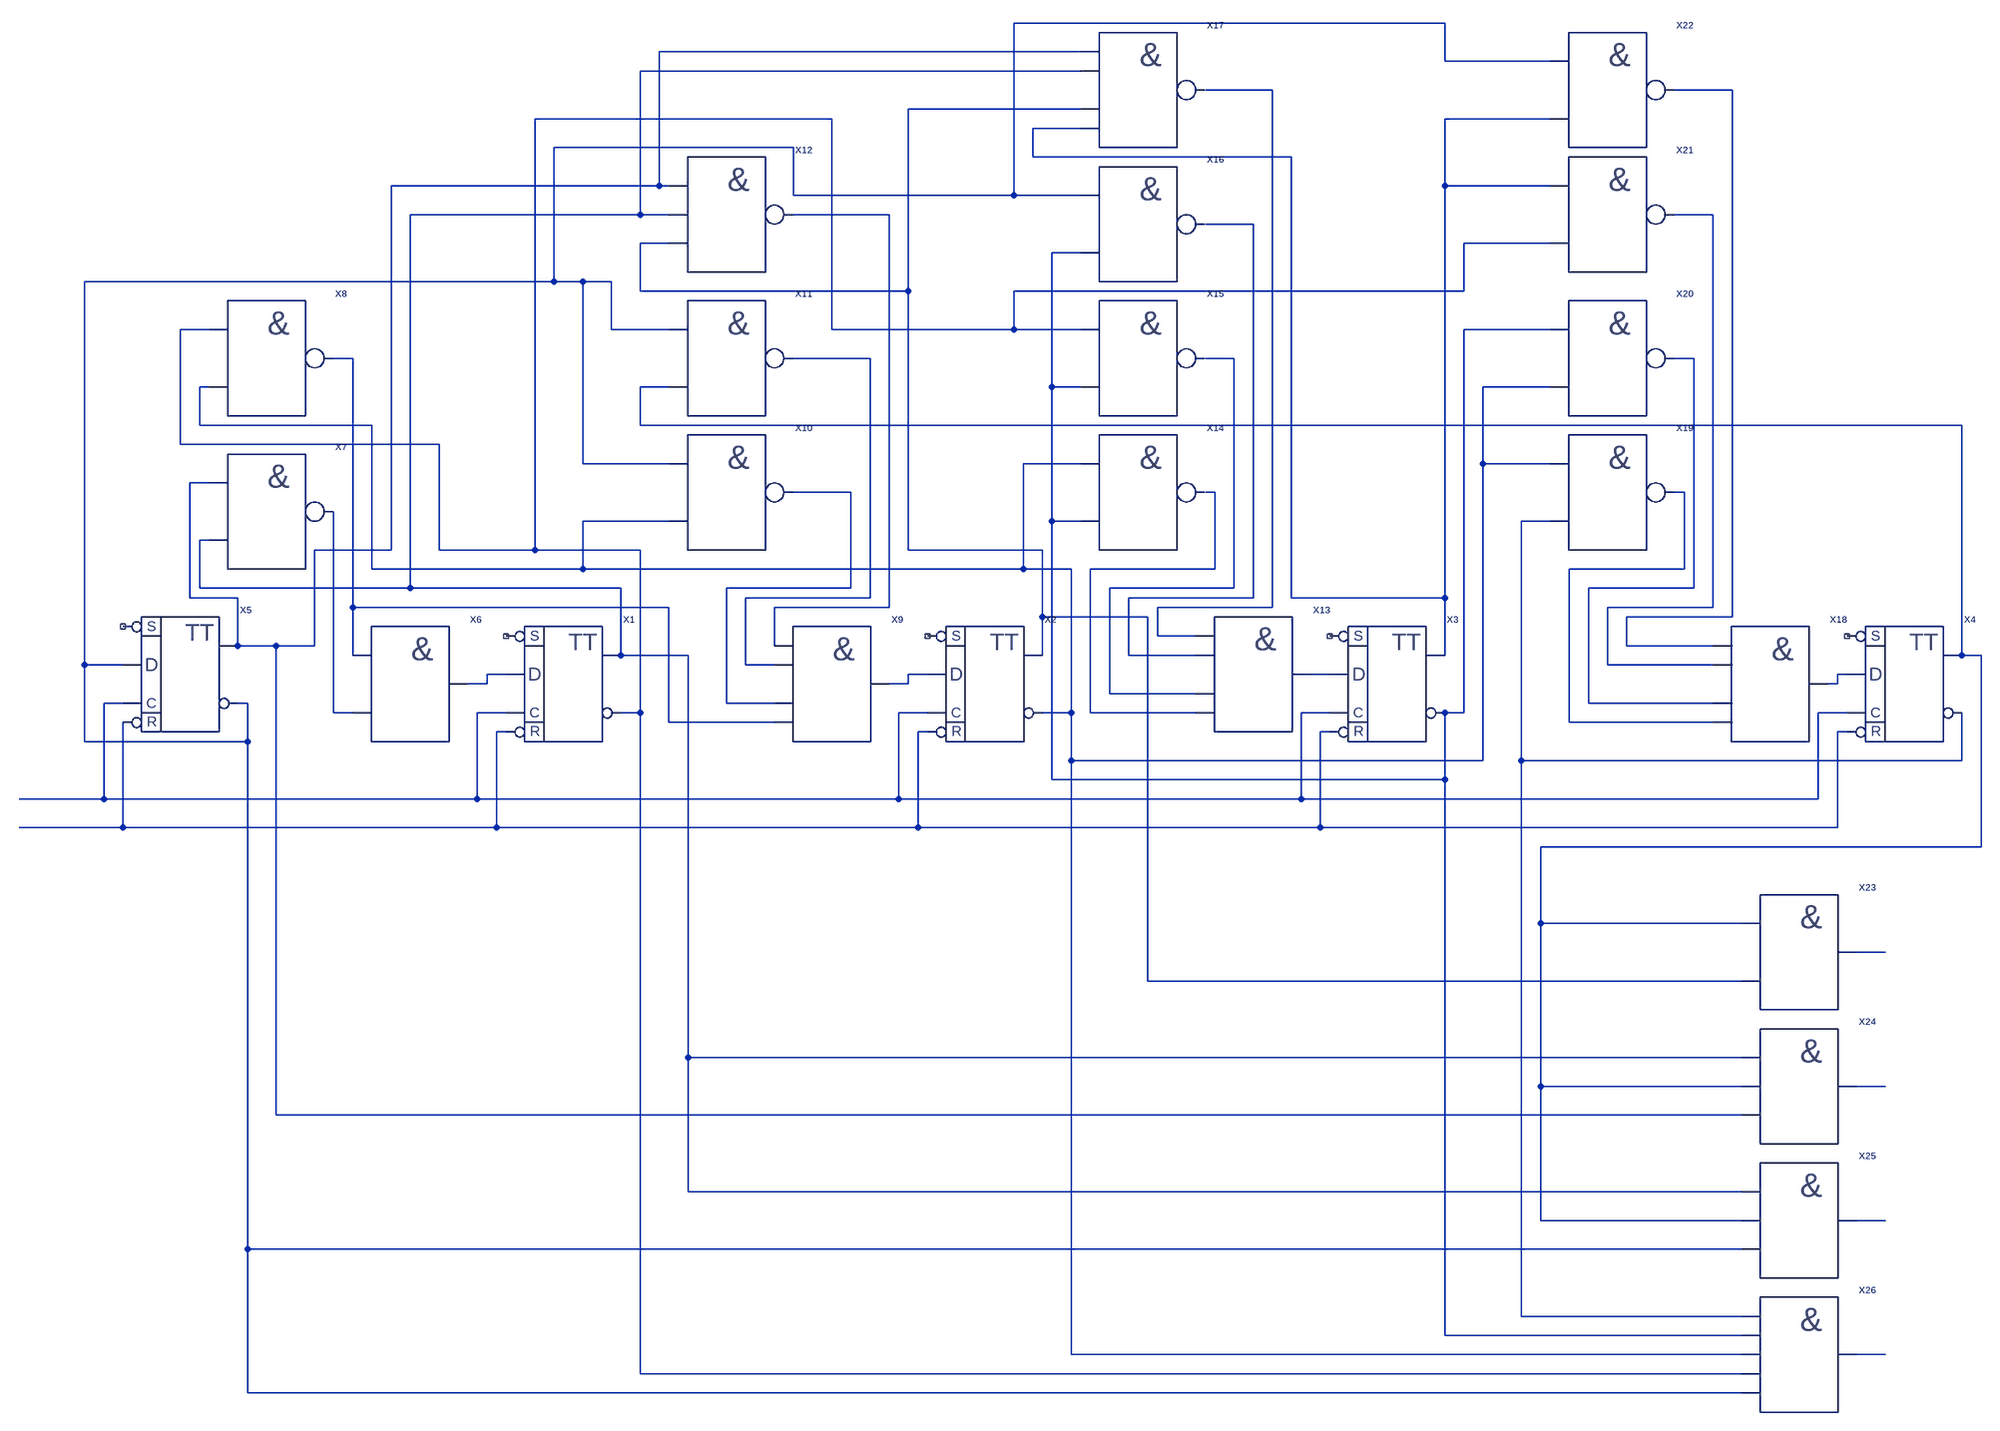
[diagram p0: schematic Draft5.asc]
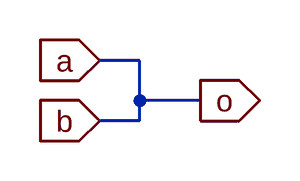
[diagram p1: sub-circuit and2.asc]
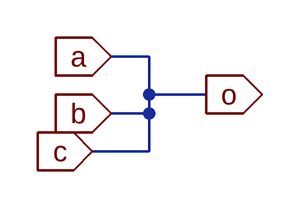
[diagram p2: sub-circuit and3.asc]
Draft5.asc, the LTspice schematic file:
Version 4
SHEET 1 2388 1492
WIRE 1488 -912 768 -912
WIRE 880 -864 176 -864
WIRE 1488 -848 1488 -912
WIRE 1664 -848 1488 -848
WIRE 880 -832 144 -832
WIRE 1200 -800 1088 -800
WIRE 1968 -800 1872 -800
WIRE 880 -768 592 -768
WIRE 464 -752 -32 -752
WIRE 1664 -752 1488 -752
WIRE 880 -736 800 -736
WIRE 400 -704 0 -704
WIRE 800 -688 800 -736
WIRE 1232 -688 800 -688
WIRE 176 -640 176 -864
WIRE 176 -640 -272 -640
WIRE 192 -640 176 -640
WIRE 1488 -640 1488 -752
WIRE 1664 -640 1488 -640
WIRE 400 -624 400 -704
WIRE 768 -624 768 -912
WIRE 768 -624 400 -624
WIRE 880 -624 768 -624
WIRE 144 -592 144 -832
WIRE 144 -592 -240 -592
WIRE 192 -592 144 -592
WIRE 560 -592 400 -592
WIRE 1936 -592 1872 -592
WIRE 1168 -576 1088 -576
WIRE 192 -544 144 -544
WIRE 1664 -544 1520 -544
WIRE 880 -528 832 -528
WIRE 0 -480 0 -704
WIRE 0 -480 -784 -480
WIRE 48 -480 0 -480
WIRE 96 -480 48 -480
WIRE 144 -464 144 -544
WIRE 592 -464 592 -768
WIRE 592 -464 144 -464
WIRE 1520 -464 1520 -544
WIRE 1520 -464 768 -464
WIRE -576 -400 -624 -400
WIRE 96 -400 96 -480
WIRE 192 -400 96 -400
WIRE 464 -400 464 -752
WIRE 768 -400 768 -464
WIRE 768 -400 464 -400
WIRE 880 -400 768 -400
WIRE 1664 -400 1520 -400
WIRE -336 -352 -368 -352
WIRE 528 -352 400 -352
WIRE 1136 -352 1088 -352
WIRE 1904 -352 1872 -352
WIRE -576 -304 -592 -304
WIRE 192 -304 144 -304
WIRE 832 -304 832 -528
WIRE 880 -304 832 -304
WIRE 1664 -304 1552 -304
WIRE -592 -240 -592 -304
WIRE -304 -240 -592 -240
WIRE 144 -240 144 -304
WIRE 2352 -240 144 -240
WIRE -624 -208 -624 -400
WIRE -192 -208 -624 -208
WIRE 48 -176 48 -480
WIRE 192 -176 48 -176
WIRE 880 -176 784 -176
WIRE 1552 -176 1552 -304
WIRE 1664 -176 1552 -176
WIRE -576 -144 -608 -144
WIRE 496 -128 400 -128
WIRE 1104 -128 1088 -128
WIRE 1888 -128 1872 -128
WIRE 192 -80 48 -80
WIRE 832 -80 832 -304
WIRE 880 -80 832 -80
WIRE 1664 -80 1616 -80
WIRE -576 -48 -592 -48
WIRE -272 -32 -272 -640
WIRE -272 -32 -400 -32
WIRE -192 -32 -192 -208
WIRE -32 -32 -32 -752
WIRE -32 -32 -192 -32
WIRE 144 -32 -32 -32
WIRE 592 -32 592 -464
WIRE 816 -32 592 -32
WIRE -304 0 -304 -240
WIRE 48 0 48 -80
WIRE 48 0 -304 0
WIRE 784 0 784 -176
WIRE 784 0 48 0
WIRE 864 0 784 0
WIRE 1104 0 1104 -128
WIRE 1104 0 896 0
WIRE 1888 0 1888 -128
WIRE 1888 0 1696 0
WIRE -592 32 -592 -48
WIRE -240 32 -240 -592
WIRE -240 32 -592 32
WIRE 112 32 -240 32
WIRE 496 32 496 -128
WIRE 496 32 288 32
WIRE 1136 32 1136 -352
WIRE 1136 32 928 32
WIRE 1904 32 1904 -352
WIRE 1904 32 1728 32
WIRE -608 48 -608 -144
WIRE -528 48 -608 48
WIRE 528 48 528 -352
WIRE 528 48 320 48
WIRE 1168 48 1168 -576
WIRE 1168 48 960 48
WIRE 1232 48 1232 -688
WIRE 1488 48 1488 -640
WIRE 1488 48 1232 48
WIRE -336 64 -336 -352
WIRE 192 64 -336 64
WIRE 560 64 560 -592
WIRE 560 64 368 64
WIRE 1200 64 1200 -800
WIRE 1200 64 1008 64
WIRE 1936 64 1936 -592
WIRE 1936 64 1760 64
WIRE 816 80 816 -32
WIRE 992 80 816 80
WIRE 1968 80 1968 -800
WIRE 1968 80 1792 80
WIRE 1008 112 1008 64
WIRE 1072 112 1008 112
WIRE -528 128 -528 48
WIRE -464 128 -528 128
WIRE -400 128 -400 -32
WIRE -400 128 -464 128
WIRE 368 128 368 64
WIRE 1792 128 1792 80
WIRE 1936 128 1792 128
WIRE -336 144 -336 64
WIRE 112 144 112 32
WIRE 224 144 112 144
WIRE 816 144 816 80
WIRE 960 144 960 48
WIRE 1072 144 960 144
WIRE 1488 144 1488 48
WIRE 2352 144 2352 -240
WIRE 2384 144 2352 144
WIRE -784 160 -784 -480
WIRE -720 160 -784 160
WIRE 320 160 320 48
WIRE 368 160 320 160
WIRE 1760 160 1760 64
WIRE 1936 160 1760 160
WIRE -80 176 -112 176
WIRE 624 176 592 176
WIRE 1296 176 1264 176
WIRE 2160 176 2144 176
WIRE -112 192 -112 176
WIRE -112 192 -144 192
WIRE 592 192 592 176
WIRE 592 192 560 192
WIRE 2144 192 2144 176
WIRE 2144 192 2128 192
WIRE 928 208 928 32
WIRE 1072 208 928 208
WIRE -720 224 -752 224
WIRE -512 224 -528 224
WIRE 288 224 288 32
WIRE 368 224 288 224
WIRE 1728 224 1728 32
WIRE 1936 224 1728 224
WIRE -368 240 -368 -96
WIRE -336 240 -368 240
WIRE -80 240 -128 240
WIRE 144 240 144 -32
WIRE 144 240 112 240
WIRE 624 240 576 240
WIRE 864 240 864 0
WIRE 864 240 816 240
WIRE 896 240 896 0
WIRE 1072 240 896 240
WIRE 1296 240 1248 240
WIRE 1520 240 1520 -400
WIRE 1520 240 1488 240
WIRE 2160 240 2112 240
WIRE 192 256 192 64
WIRE 368 256 192 256
WIRE 1696 256 1696 0
WIRE 1936 256 1696 256
WIRE -80 272 -96 272
WIRE 624 272 608 272
WIRE 1296 272 1280 272
WIRE 2160 272 2144 272
WIRE -784 288 -784 160
WIRE -512 288 -512 224
WIRE -512 288 -784 288
WIRE 864 320 864 240
WIRE 1552 320 1552 -176
WIRE 1552 320 864 320
WIRE 1616 320 1616 -80
WIRE 2352 320 2352 240
WIRE 2352 320 1616 320
WIRE 832 352 832 -80
WIRE 1488 352 1488 240
WIRE 1488 352 832 352
WIRE -752 384 -752 224
WIRE -752 384 -960 384
WIRE -128 384 -128 240
WIRE -128 384 -752 384
WIRE 576 384 576 240
WIRE 576 384 -128 384
WIRE 1248 384 1248 240
WIRE 1248 384 576 384
WIRE 2112 384 2112 240
WIRE 2112 384 1248 384
WIRE -720 432 -720 256
WIRE -720 432 -960 432
WIRE -96 432 -96 272
WIRE -96 432 -720 432
WIRE 608 432 608 272
WIRE 608 432 -96 432
WIRE 1280 432 1280 272
WIRE 1280 432 608 432
WIRE 2144 432 2144 272
WIRE 2144 432 1280 432
WIRE 2384 464 2384 144
WIRE 2384 464 1648 464
WIRE 1648 592 1648 464
WIRE 1984 592 1648 592
WIRE 2224 640 2176 640
WIRE 992 688 992 80
WIRE 1984 688 992 688
WIRE 224 816 224 144
WIRE 1984 816 224 816
WIRE 1648 864 1648 592
WIRE 1984 864 1648 864
WIRE 2224 864 2176 864
WIRE -464 912 -464 128
WIRE 1984 912 -464 912
WIRE 224 1040 224 816
WIRE 1984 1040 224 1040
WIRE 1648 1088 1648 864
WIRE 1984 1088 1648 1088
WIRE 2224 1088 2176 1088
WIRE -512 1136 -512 288
WIRE 1984 1136 -512 1136
WIRE 1616 1248 1616 320
WIRE 1984 1248 1616 1248
WIRE 1488 1280 1488 352
WIRE 1984 1280 1488 1280
WIRE 864 1312 864 320
WIRE 1984 1312 864 1312
WIRE 2224 1312 2176 1312
WIRE 144 1344 144 240
WIRE 1984 1344 144 1344
WIRE -512 1376 -512 1136
WIRE 1984 1376 -512 1376
SYMBOL dTrig 16 192 R0
SYMATTR InstName X1
SYMBOL dTrig 720 192 R0
SYMATTR InstName X2
SYMBOL dTrig 1392 192 R0
SYMATTR InstName X3
SYMBOL dTrig 2256 192 R0
SYMATTR InstName X4
SYMBOL dTrig -624 176 R0
SYMATTR InstName X5
SYMBOL AND2 -240 192 R0
SYMATTR InstName X6
SYMBOL NAND2 -480 -96 R0
SYMATTR InstName X7
SYMBOL NAND2 -480 -352 R0
SYMATTR InstName X8
SYMBOL AND4 464 192 R0
SYMATTR InstName X9
SYMBOL NAND2 288 -128 R0
SYMATTR InstName X10
SYMBOL NAND2 288 -352 R0
SYMATTR InstName X11
SYMBOL NAND3 288 -592 R0
SYMATTR InstName X12
SYMBOL AND4 1168 176 R0
SYMATTR InstName X13
SYMBOL NAND4 976 -800 R0
SYMATTR InstName X17
SYMBOL NAND2 976 -128 R0
SYMATTR InstName X14
SYMBOL NAND2 976 -352 R0
SYMATTR InstName X15
SYMBOL NAND2 976 -576 R0
SYMATTR InstName X16
SYMBOL AND4 2032 192 R0
SYMATTR InstName X18
SYMBOL NAND2 1760 -128 R0
SYMATTR InstName X19
SYMBOL NAND2 1760 -352 R0
SYMATTR InstName X20
SYMBOL NAND2 1760 -592 R0
SYMATTR InstName X21
SYMBOL NAND2 1760 -800 R0
SYMATTR InstName X22
SYMBOL AND2 2080 640 R0
SYMATTR InstName X23
SYMBOL AND3 2080 864 R0
SYMATTR InstName X24
SYMBOL AND3 2080 1088 R0
SYMATTR InstName X25
SYMBOL AND5 2080 1312 R0
SYMATTR InstName X26

and2.asc, the sub-circuit schematic file:
Version 4
SHEET 1 880 680
WIRE 96 80 64 80
WIRE 96 112 96 80
WIRE 144 112 96 112
WIRE 96 128 96 112
WIRE 96 128 64 128
FLAG 64 80 a
IOPIN 64 80 In
FLAG 64 128 b
IOPIN 64 128 In
FLAG 144 112 o
IOPIN 144 112 Out

and3.asc, the sub-circuit schematic file:
Version 4
SHEET 1 880 680
WIRE 96 80 64 80
WIRE 96 112 96 80
WIRE 144 112 96 112
WIRE 96 128 96 112
WIRE 96 128 64 128
WIRE 96 160 96 128
WIRE 96 160 48 160
FLAG 64 80 a
IOPIN 64 80 In
FLAG 64 128 b
IOPIN 64 128 In
FLAG 144 112 o
IOPIN 144 112 Out
FLAG 48 160 c
IOPIN 48 160 In

The netlist it stands for:
* Draft5.asc
XX1 NC_01 N023 N027 N029 N003 N007 dTrig  ; pins s d c r q nq
XX2 NC_02 N024 N027 N029 N006 N017 dTrig  ; pins s d c r q nq
XX3 NC_03 N025 N027 N029 N008 N012 dTrig  ; pins s d c r q nq
XX4 NC_04 N026 N027 N029 N018 N022 dTrig  ; pins s d c r q nq
XX5 NC_05 N001 N027 N029 N002 N001 dTrig  ; pins s d c r q nq
XX6 N013 N028 N023 and2
XX7 N002 N003 N028 NAND2  ; pins a b o
XX8 N007 N017 N013 NAND2  ; pins a b o
XX9 N009 N013 N024 N014 N019 AND4  ; pins a b o c d
XX10 N001 N017 N019 NAND2  ; pins a b o
XX11 N001 N018 N014 NAND2  ; pins a b o
XX12 N002 N006 N009 N003 NAND3  ; pins a b o c
XX13 N004 N020 N025 N011 N015 AND4  ; pins a b o c d
XX17 N002 N008 N004 N006 N003 NAND4  ; pins a b o c c1
XX14 N017 N012 N020 NAND2  ; pins a b o
XX15 N007 N012 N015 NAND2  ; pins a b o
XX16 N001 N012 N011 NAND2  ; pins a b o
XX18 N005 N021 N026 N010 N016 AND4  ; pins a b o c d
XX19 N017 N022 N021 NAND2  ; pins a b o
XX20 N012 N017 N016 NAND2  ; pins a b o
XX21 N008 N007 N010 NAND2  ; pins a b o
XX22 N001 N008 N005 NAND2  ; pins a b o
XX23 N018 N006 N030 and2
XX24 N003 N002 N031 N018 and3
XX25 N003 N001 N032 N018 and3
XX26 N022 N001 N033 N012 N007 N017 AND5  ; pins a b o c d e

* block symbol definitions
.subckt and2 a b o
.ends and2

.subckt and3 a b o c
.ends and3

.backanno
.end